# EAGLE design LSM9DS0_Breakout_Board (EAGLE 7.1.0)
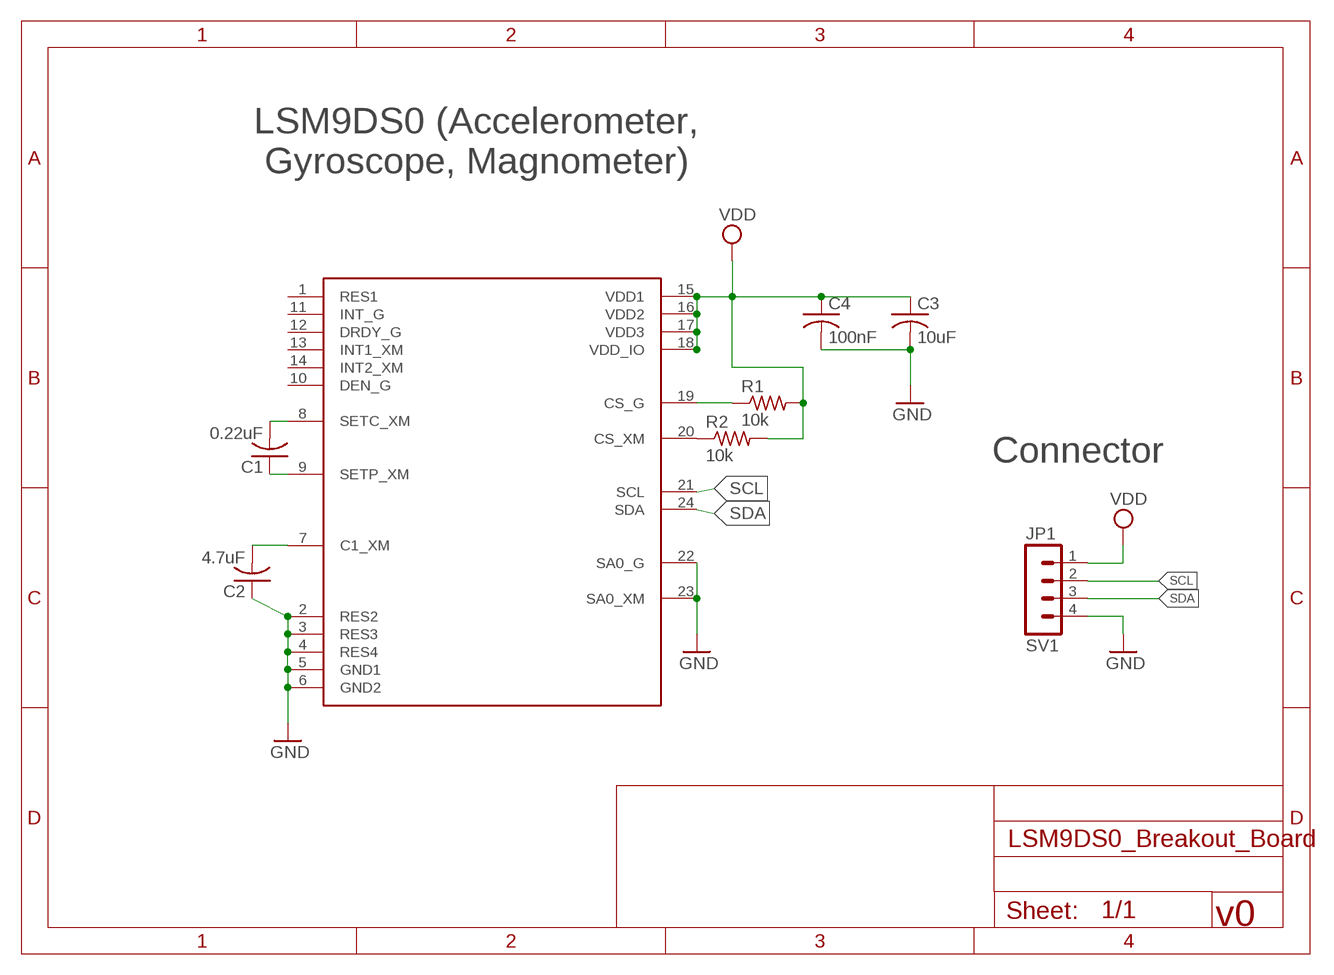
[diagram p0: schematic, sheet 1]

## Parts
C1  0.22uF  C-USC0805  [C0805]
C2  4.7uF  C-USC0805  [C0805]
C3  10uF  C-USC0805  [C0805]
C4  100nF  C-USC0805  [C0805]
R1  10k  R-US_R0805  [R0805]
R2  10k  R-US_R0805  [R0805]
SV1  JP1  MA04-1  [MA04-1]
U1  LSM9DS0  [LGA-24]

## Nets
GND: C2.1 C3.2 C4.2 SV1.4 U1.2(RES2) U1.3(RES3) U1.4(RES4) U1.5(GND1) U1.6(GND2) U1.22(SA0_G) U1.23(SA0_XM)
N$20: C2.2 U1.7(C1_XM)
N$21: C1.2 U1.8(SETC_XM)
N$22: C1.1 U1.9(SETP_XM)
N$23: R1.1 U1.19(CS_G)
N$24: R2.1 U1.20(CS_XM)
SCL: SV1.2 U1.21(SCL)
SDA: SV1.3 U1.24(SDA)
VDD: C3.1 C4.1 R1.2 R2.2 SV1.1 U1.15(VDD1) U1.16(VDD2) U1.17(VDD3) U1.18(VDD_IO)
Unconnected: U1.1(RES1) U1.10(DEN_G) U1.11(INT_G) U1.12(DRDY_G) U1.13(INT1_XM) U1.14(INT2_XM)

## Notes on the sheet
- LSM9DS0 (Accelerometer,
   Gyroscope, Magnometer)
- Connector
- v0

## Library data of the parts
C1-C4 = rcl:C-US: CAPACITOR, American symbol
R1 R2 = resistor:R-US_: RESISTOR, American symbol
SV1 = con-lstb:MA04-1: PIN HEADER; OC_FARNELL: unknown; OC_NEWARK: unknown
U1 = Controller:LSM9DS0: IMU

## Net classes
1 RFSIG: width 0.457 mm, clearance 0.205 mm to class 0, clearance 0.205 mm

## Board
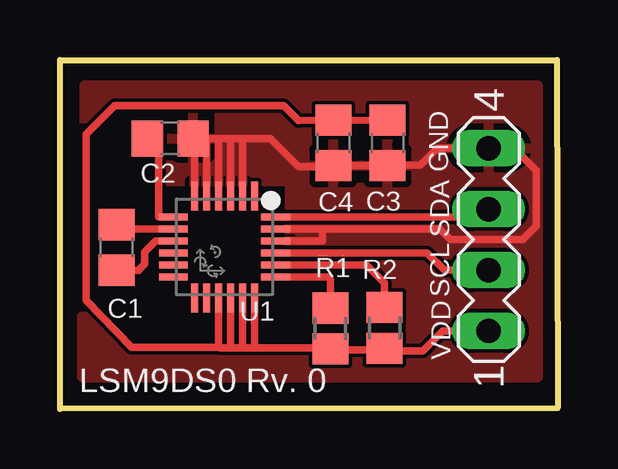
[diagram p1: board, top side]

Size 20.75 x 14.55 mm. Coordinates in mm from the lower left corner, seen from the top.
Outline: 0,0 0,14.55 20.73,14.55 20.75,0.03 0,0
Copper layers (1*16): Top 0.035559375mm / dielectric 1.501140625mm / Bottom 0.035559375mm
Design rules "4pcb-33board *": minimum track width 8mil, minimum drill 15mil, track to track 6mil, track to pad 6mil, pad to pad 6mil, via to via 6mil, smd to smd 6mil, copper to edge 10mil, drill to drill 10mil, minimum pad ring 10mil, minimum via ring 8mil, stop-mask expansion 4mil, vias tented up to drill 0mil, thermal gap 10mil
bRestrict: area 5.4,5.2 to 8.3,8.3

### Footprints (pad centres in the part's own frame; a part is rotated, then mirrored left to right if it is on the bottom)
C0805 = smd 1.3 x 1.5: 1 -0.95,0; 2 0.95,0
R0805 = smd 1.3 x 1.5: 1 -0.85,0; 2 0.85,0
MA04-1 = drill 1.016 long: 1 -3.81,0; 2 -1.27,0; 3 1.27,0; 4 3.81,0
LGA-24 = smd 1.208 x 0.29: 1 -2.129,1.25; 2 -2.129,0.75; 3 -2.129,0.25; 4 -2.129,-0.25; 5 -2.129,-0.75; 6 -2.129,-1.25; 13 2.129,-1.25; 14 2.129,-0.75; 15 2.129,-0.25; 16 2.129,0.25; 17 2.129,0.75; 18 2.129,1.25 | smd 0.29 x 1.208: 7 -1.25,-2.129; 8 -0.75,-2.129; 9 -0.25,-2.129; 10 0.25,-2.129; 11 0.75,-2.129; 12 1.25,-2.129; 19 1.25,2.129; 20 0.75,2.129; 21 0.25,2.129; 22 -0.25,2.129; 23 -0.75,2.129; 24 -1.25,2.129

### Placement (x,y rotation side)
C1  2.36,6.73 90 top
C2  4.6,11.28 180 top
C3  13.67,11.1 270 top
C4  11.4,11.1 270 top
R1  11.28,3.35 270 top
R2  13.54,3.38 270 top
SV1  17.88,7.06 90 top
U1  6.86,6.76 270 top

### Tracks (layer width: path | path; a pad name or v marks a point on that pad's centre or on a via)
GND
  Top 0.305: U1.6 5.61,11.22 C2.1 6.11,11.28 | 6.11,11.28 6.61,11.28 | 6.61,11.28 7.11,11.28 | 7.11,11.28 7.61,11.28 | 7.61,11.28 8.79,11.28 9.96,10.11 11.39,10.11 C4.2 C3.2 13.68,10.16 15.04,10.16 15.75,10.87 SV1.4 18.92,10.87 19.86,9.93 19.86,7.62 19.3,7.06 16.28,7.06 15.84,7.51 10.95,7.51 | U1.4 6.61,11.28 | U1.3 7.11,11.28 | U1.5 6.11,11.28 | U1.2 7.61,11.28 | U1.23 10.95,7.51 | U1.22 9.14,7.01 10.95,7.01 10.95,7.51
  pour Top: 0.91,1.32 19.94,1.32 19.94,13.49 1.02,13.49 1.02,9.5 9.58,9.5 9.58,3.86 0.91,3.86
N$20
  Top 0.305: C2.2 arc-90 4.11,10.81 4.11,8.03 arc90 4.13,8.01 U1.7
N$21
  Top 0.305: U1.8 2.54,7.51 C1.2
N$22
  Top 0.305: U1.9 3.98,7.01 3.53,6.55 3.53,6.05 3.28,5.79 3.28,5.78 C1.1
N$23
  Top 0.305: R1.1 11.28,5.38 11.18,5.51 9.01,5.51 U1.19
N$24
  Top 0.305: U1.20 12.79,6.01 13.54,5.26 R2.1
SCL
  Top 0.305: SV1.2 16.03,5.79 15.31,6.51 U1.21
SDA
  Top 0.305: U1.24 17.56,8.01 SV1.3
VDD
  Top 0.305: SV1.1 15.98,3.25 15.14,2.41 13.65,2.41 R2.2 13.47,2.46 11.86,2.46 | U1.15 6.61,2.56 | 6.61,2.56 6.68,2.54 7.16,2.54 | 7.16,2.54 7.59,2.54 | 7.59,2.54 8.13,2.54 | 8.13,2.54 11.79,2.54 11.86,2.46 | 11.86,2.46 11.32,2.46 R1.2 | U1.16 7.11,2.59 7.16,2.54 | U1.17 7.61,2.55 7.59,2.54 | U1.18 8.11,2.56 8.13,2.54 | C3.1 13.66,12.02 C4.1 9.95,12.02 9.32,12.65 2.29,12.65 1.09,11.46 1.09,4.52 3,2.57 3.04,2.56 6.61,2.56

### Text on the board
tPlace: GND | SDA | SCL | VDD | LSM9DS0 Rv. 0
tDocu: >Info / Board Name: LSM9DS0 Breakout Board / Part Number: 0 / Number of Layers: 2 / Dimension X= 0.8169 inch / Dimension Y= 0.5590 inch / Board Material Type: FR-4 / Solder Mask Color: Green / Silkscreen Color: White / Finish Plating: HASAL / Revision Number: 0
bDocu: 0.276 inch / 7.0104 mm | 0.276 inch / 7.0104 mm